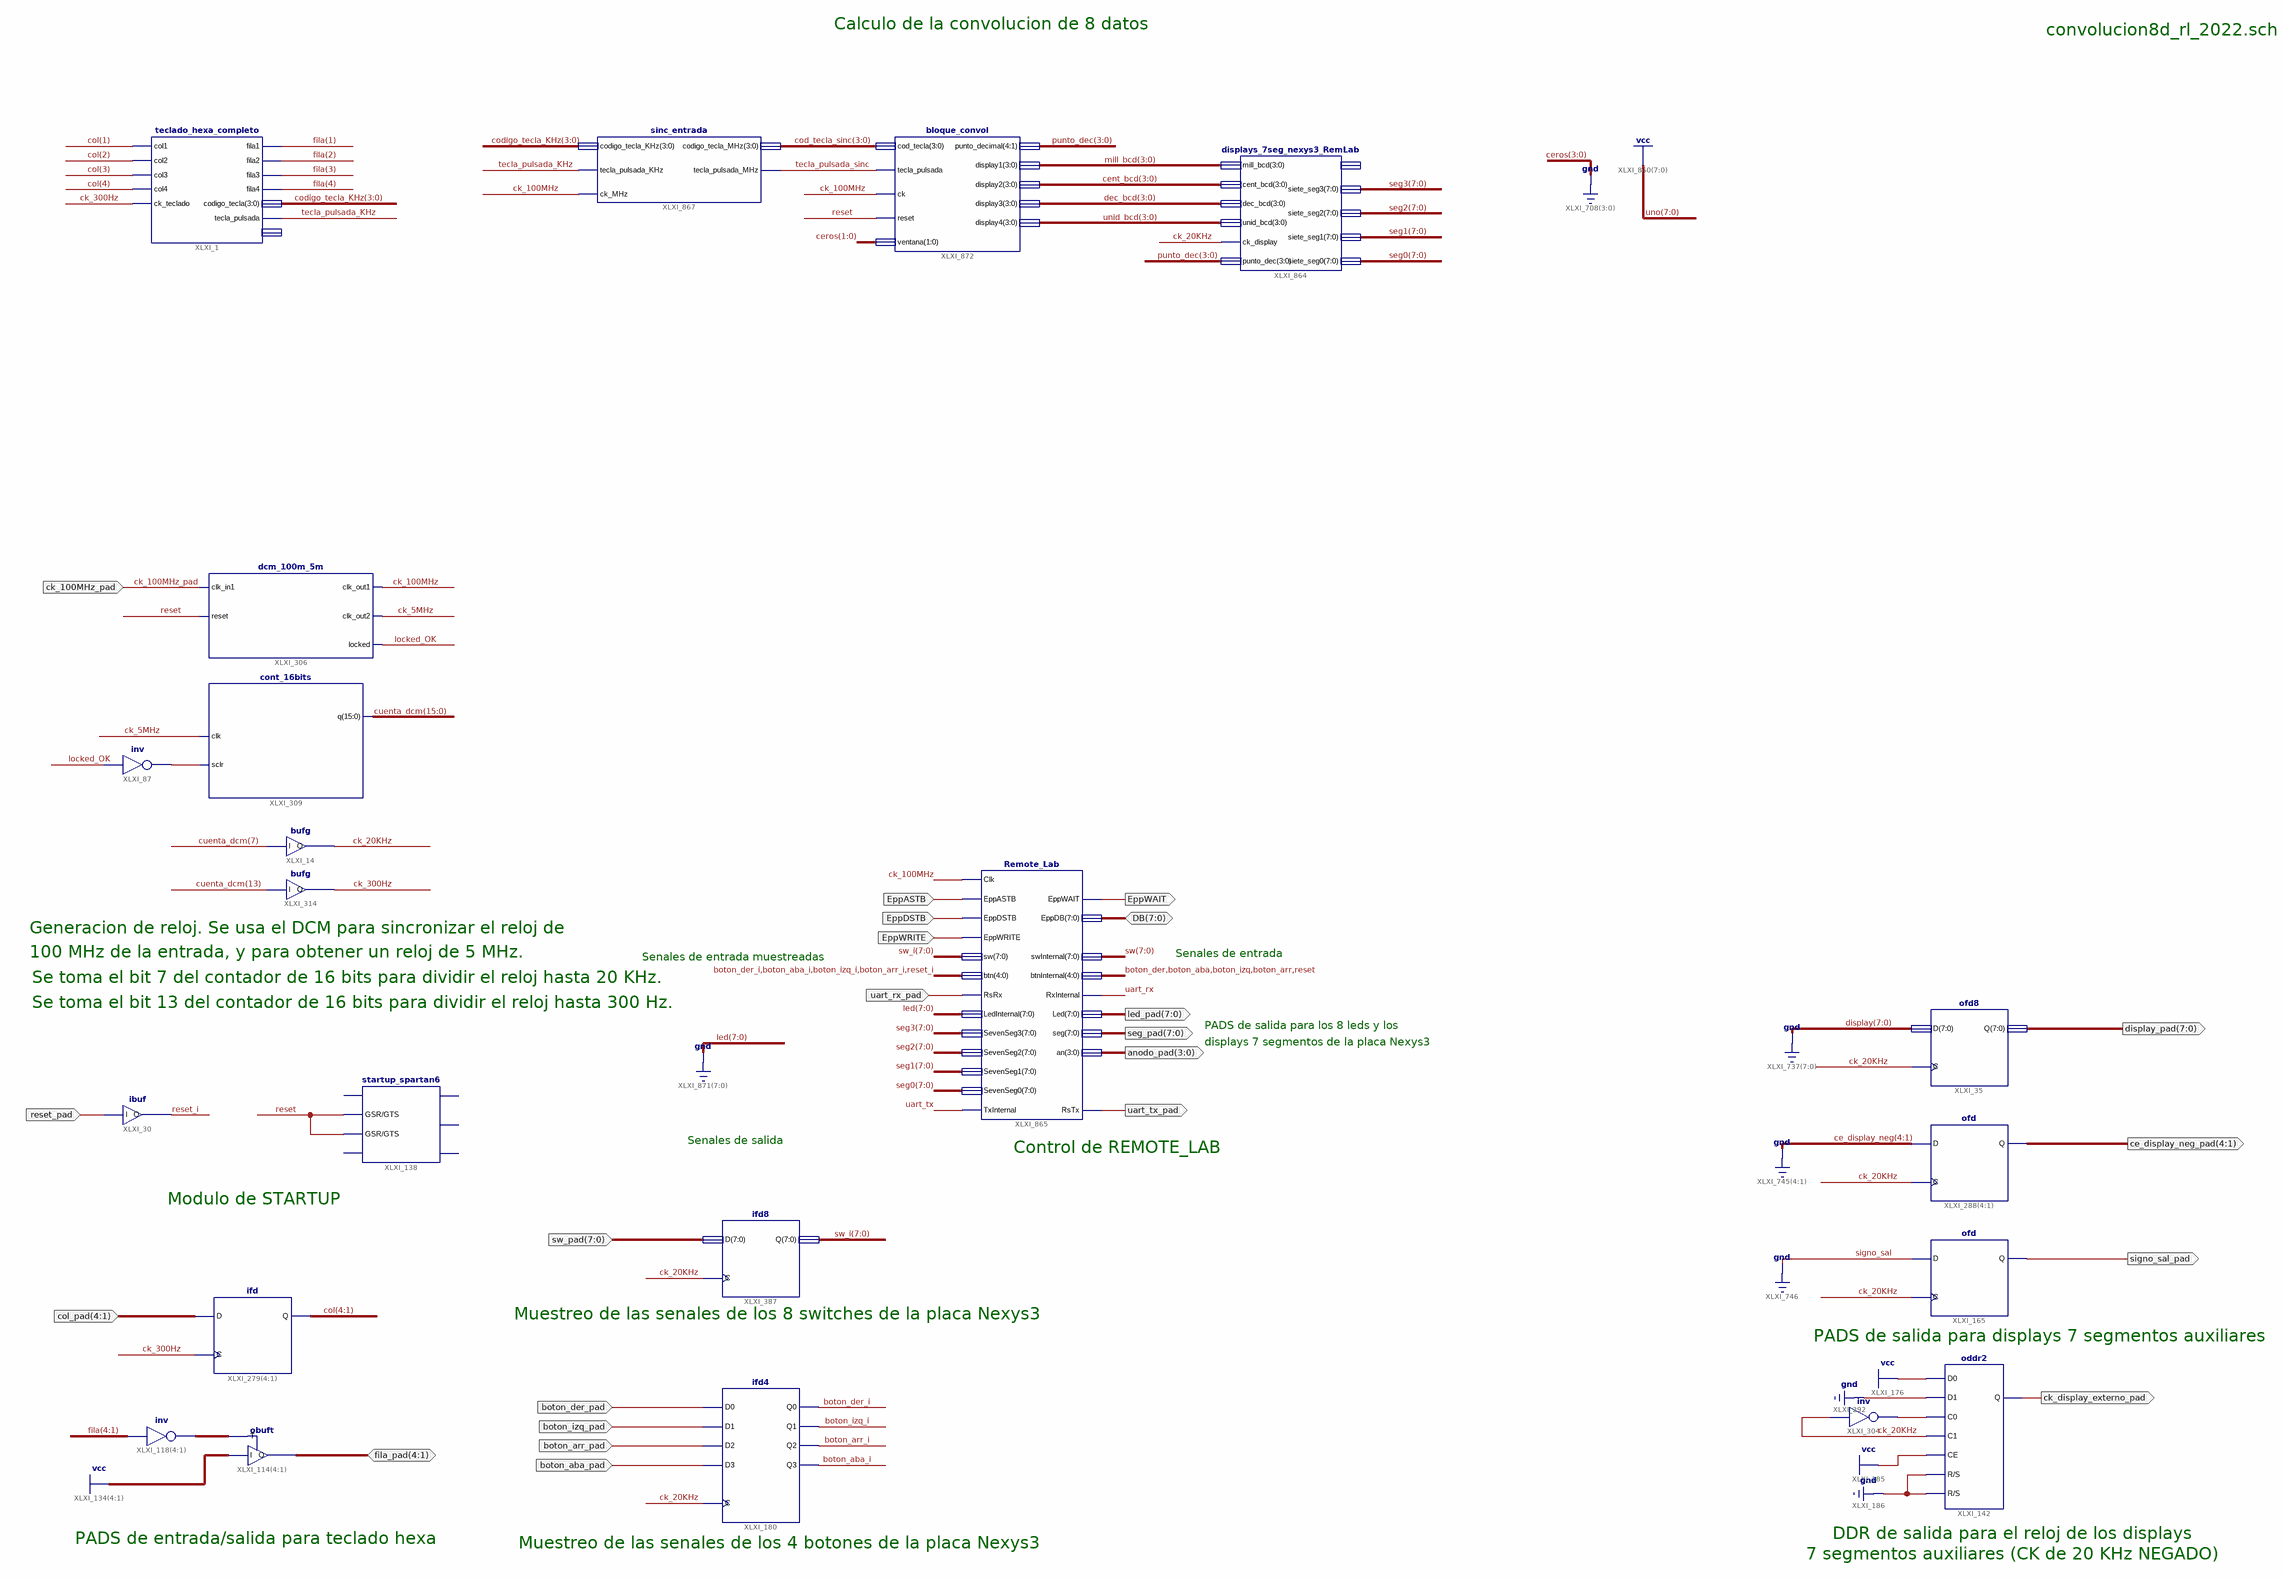
[diagram p0: schematic sheet 1]
// Xilinx ISE schematic convol_top_rl_2022.sch (spartan6) as structural Verilog: 22 symbols, 23 ports
module convol_top_rl_2022 (
  input  [4:1] col_pad,
  input  reset_pad,
  input  boton_der_pad,
  input  boton_izq_pad,
  input  boton_arr_pad,
  input  boton_aba_pad,
  input  [7:0] sw_pad,
  input  EppASTB,
  input  EppDSTB,
  input  EppWRITE,
  input  uart_rx_pad,
  input  ck_100MHz_pad,
  inout  [4:1] fila_pad,
  inout  [7:0] DB,
  output [7:0] display_pad,
  output [4:1] ce_display_neg_pad,
  output signo_sal_pad,
  output ck_display_externo_pad,
  output EppWAIT,
  output [7:0] led_pad,
  output [7:0] seg_pad,
  output [3:0] anodo_pad,
  output uart_tx_pad
);

  wire boton_aba, boton_aba_i, boton_arr, boton_arr_i, boton_der, boton_der_i, boton_izq, boton_izq_i,
       ck_5MHz, ck_20KHz, ck_100MHz, ck_300Hz, locked_OK, reset, reset_i, tecla_pulsada_KHz,
       tecla_pulsada_sinc, uart_rx, uart_tx, XLXN_1, XLXN_460;
  wire [3:0] cent_bcd, cod_tecla_sinc, codigo_tecla_KHz, dec_bcd, mill_bcd, punto_dec, unid_bcd;
  wire [4:1] col, fila, XLXN_407;
  wire [7:0] seg0, seg1, seg2, seg3, sw, sw_i;
  wire [15:0] cuenta_dcm;

  obuft XLXI_114[4:1] (.I(4'b1111), .T(XLXN_407), .O(fila_pad));
  assign XLXN_407 = ~fila;  // inv XLXI_118[4..1], 4 bits wide
  ifd XLXI_279[4:1] (.C(ck_300Hz), .D(col_pad), .Q(col));
  ibuf XLXI_30 (.I(reset_pad), .O(reset_i));
  startup_spartan6 XLXI_138 (.GSR(reset), .GTS(reset));  // open: CLK, KEYCLEARB, CFGCLK, CFGMCLK, EOS
  bufg XLXI_14 (.I(cuenta_dcm[7]), .O(ck_20KHz));
  bufg XLXI_314 (.I(cuenta_dcm[13]), .O(ck_300Hz));
  ofd XLXI_288[4:1] (.C(ck_20KHz), .D(4'b0000), .Q(ce_display_neg_pad));
  ofd XLXI_165 (.C(ck_20KHz), .D(1'b0), .Q(signo_sal_pad));
  oddr2 XLXI_142 (
    .D0(1'b1), .D1(1'b0), .C0(XLXN_460), .C1(ck_20KHz), .CE(1'b1), .R(1'b0), .Q(ck_display_externo_pad),
    .S(1'b0));
  not XLXI_304 (XLXN_460, ck_20KHz);
  ofd8 XLXI_35 (.C(ck_20KHz), .D({8{1'b0}}), .Q(display_pad));
  ifd4 XLXI_180 (
    .C(ck_20KHz), .D0(boton_der_pad), .D1(boton_izq_pad), .D2(boton_arr_pad), .D3(boton_aba_pad),
    .Q0(boton_der_i), .Q1(boton_izq_i), .Q2(boton_arr_i), .Q3(boton_aba_i));
  ifd8 XLXI_387 (.C(ck_20KHz), .D(sw_pad), .Q(sw_i));
  Remote_Lab XLXI_865 (
    .Clk(ck_100MHz), .EppASTB(EppASTB), .EppDSTB(EppDSTB), .EppWRITE(EppWRITE), .RsRx(uart_rx_pad),
    .TxInternal(uart_tx), .sw(sw_i), .btn({boton_der_i, boton_aba_i, boton_izq_i, boton_arr_i, reset_i}),
    .LedInternal({8{1'b0}}), .SevenSeg3(seg3), .SevenSeg2(seg2), .SevenSeg1(seg1), .SevenSeg0(seg0),
    .EppDB(DB), .EppWAIT(EppWAIT), .RxInternal(uart_rx), .RsTx(uart_tx_pad), .swInternal(sw),
    .btnInternal({boton_der, boton_aba, boton_izq, boton_arr, reset}), .Led(led_pad), .seg(seg_pad),
    .an(anodo_pad));
  teclado_hexa_completo XLXI_1 (
    .col1(col[1]), .col2(col[2]), .col3(col[3]), .col4(col[4]), .fila1(fila[1]), .fila2(fila[2]),
    .fila3(fila[3]), .fila4(fila[4]), .ck_teclado(ck_300Hz), .codigo_tecla(codigo_tecla_KHz),
    .tecla_pulsada(tecla_pulsada_KHz));  // open: tecla
  sinc_entrada XLXI_867 (
    .codigo_tecla_KHz(codigo_tecla_KHz), .codigo_tecla_MHz(cod_tecla_sinc),
    .tecla_pulsada_MHz(tecla_pulsada_sinc), .tecla_pulsada_KHz(tecla_pulsada_KHz), .ck_MHz(ck_100MHz));
  displays_7seg_nexys3_RemLab XLXI_864 (
    .mill_bcd(mill_bcd), .cent_bcd(cent_bcd), .dec_bcd(dec_bcd), .unid_bcd(unid_bcd), .ck_display(ck_20KHz),
    .punto_dec(punto_dec), .siete_seg3(seg3), .siete_seg2(seg2), .siete_seg1(seg1), .siete_seg0(seg0));  // open: anodo
  bloque_convol XLXI_872 (
    .ck(ck_100MHz), .cod_tecla(cod_tecla_sinc), .tecla_pulsada(tecla_pulsada_sinc), .reset(reset),
    .punto_decimal(punto_dec), .display1(mill_bcd), .display2(cent_bcd), .display3(dec_bcd),
    .display4(unid_bcd), .ventana(2'b00));
  dcm_100m_5m XLXI_306 (
    .clk_in1(ck_100MHz_pad), .clk_out1(ck_100MHz), .clk_out2(ck_5MHz), .reset(reset), .locked(locked_OK));
  cont_16bits XLXI_309 (.clk(ck_5MHz), .sclr(XLXN_1), .q(cuenta_dcm));
  not XLXI_87 (XLXN_1, locked_OK);

  // Notes on the sheet:
  //   Calculo de la convolucion de 8 datos
  //   convolucion8d_rl_2022.sch
  //   Generacion de reloj. Se usa el DCM para sincronizar el reloj de
  //   100 MHz de la entrada, y para obtener un reloj de 5 MHz.
  //   Senales de entrada
  //   Senales de entrada muestreadas
  //   Se toma el bit 7 del contador de 16 bits para dividir el reloj hasta 20 KHz.
  //   Se toma el bit 13 del contador de 16 bits para dividir el reloj hasta 300 Hz.
  //   PADS de salida para los 8 leds y los
  //   displays 7 segmentos de la placa Nexys3
  //   Senales de salida
  //   Control de REMOTE_LAB
  //   Modulo de STARTUP
  //   Muestreo de las senales de los 8 switches de la placa Nexys3
  //   PADS de salida para displays 7 segmentos auxiliares
  //   DDR de salida para el reloj de los displays
  //   PADS de entrada/salida para teclado hexa
  //   Muestreo de las senales de los 4 botones de la placa Nexys3
  //   7 segmentos auxiliares (CK de 20 KHz NEGADO)
endmodule
